# Altium schematic sheet 12V_Load_Switches.SchDoc
size A3; SheetNumber: 16; SheetTotal: 17
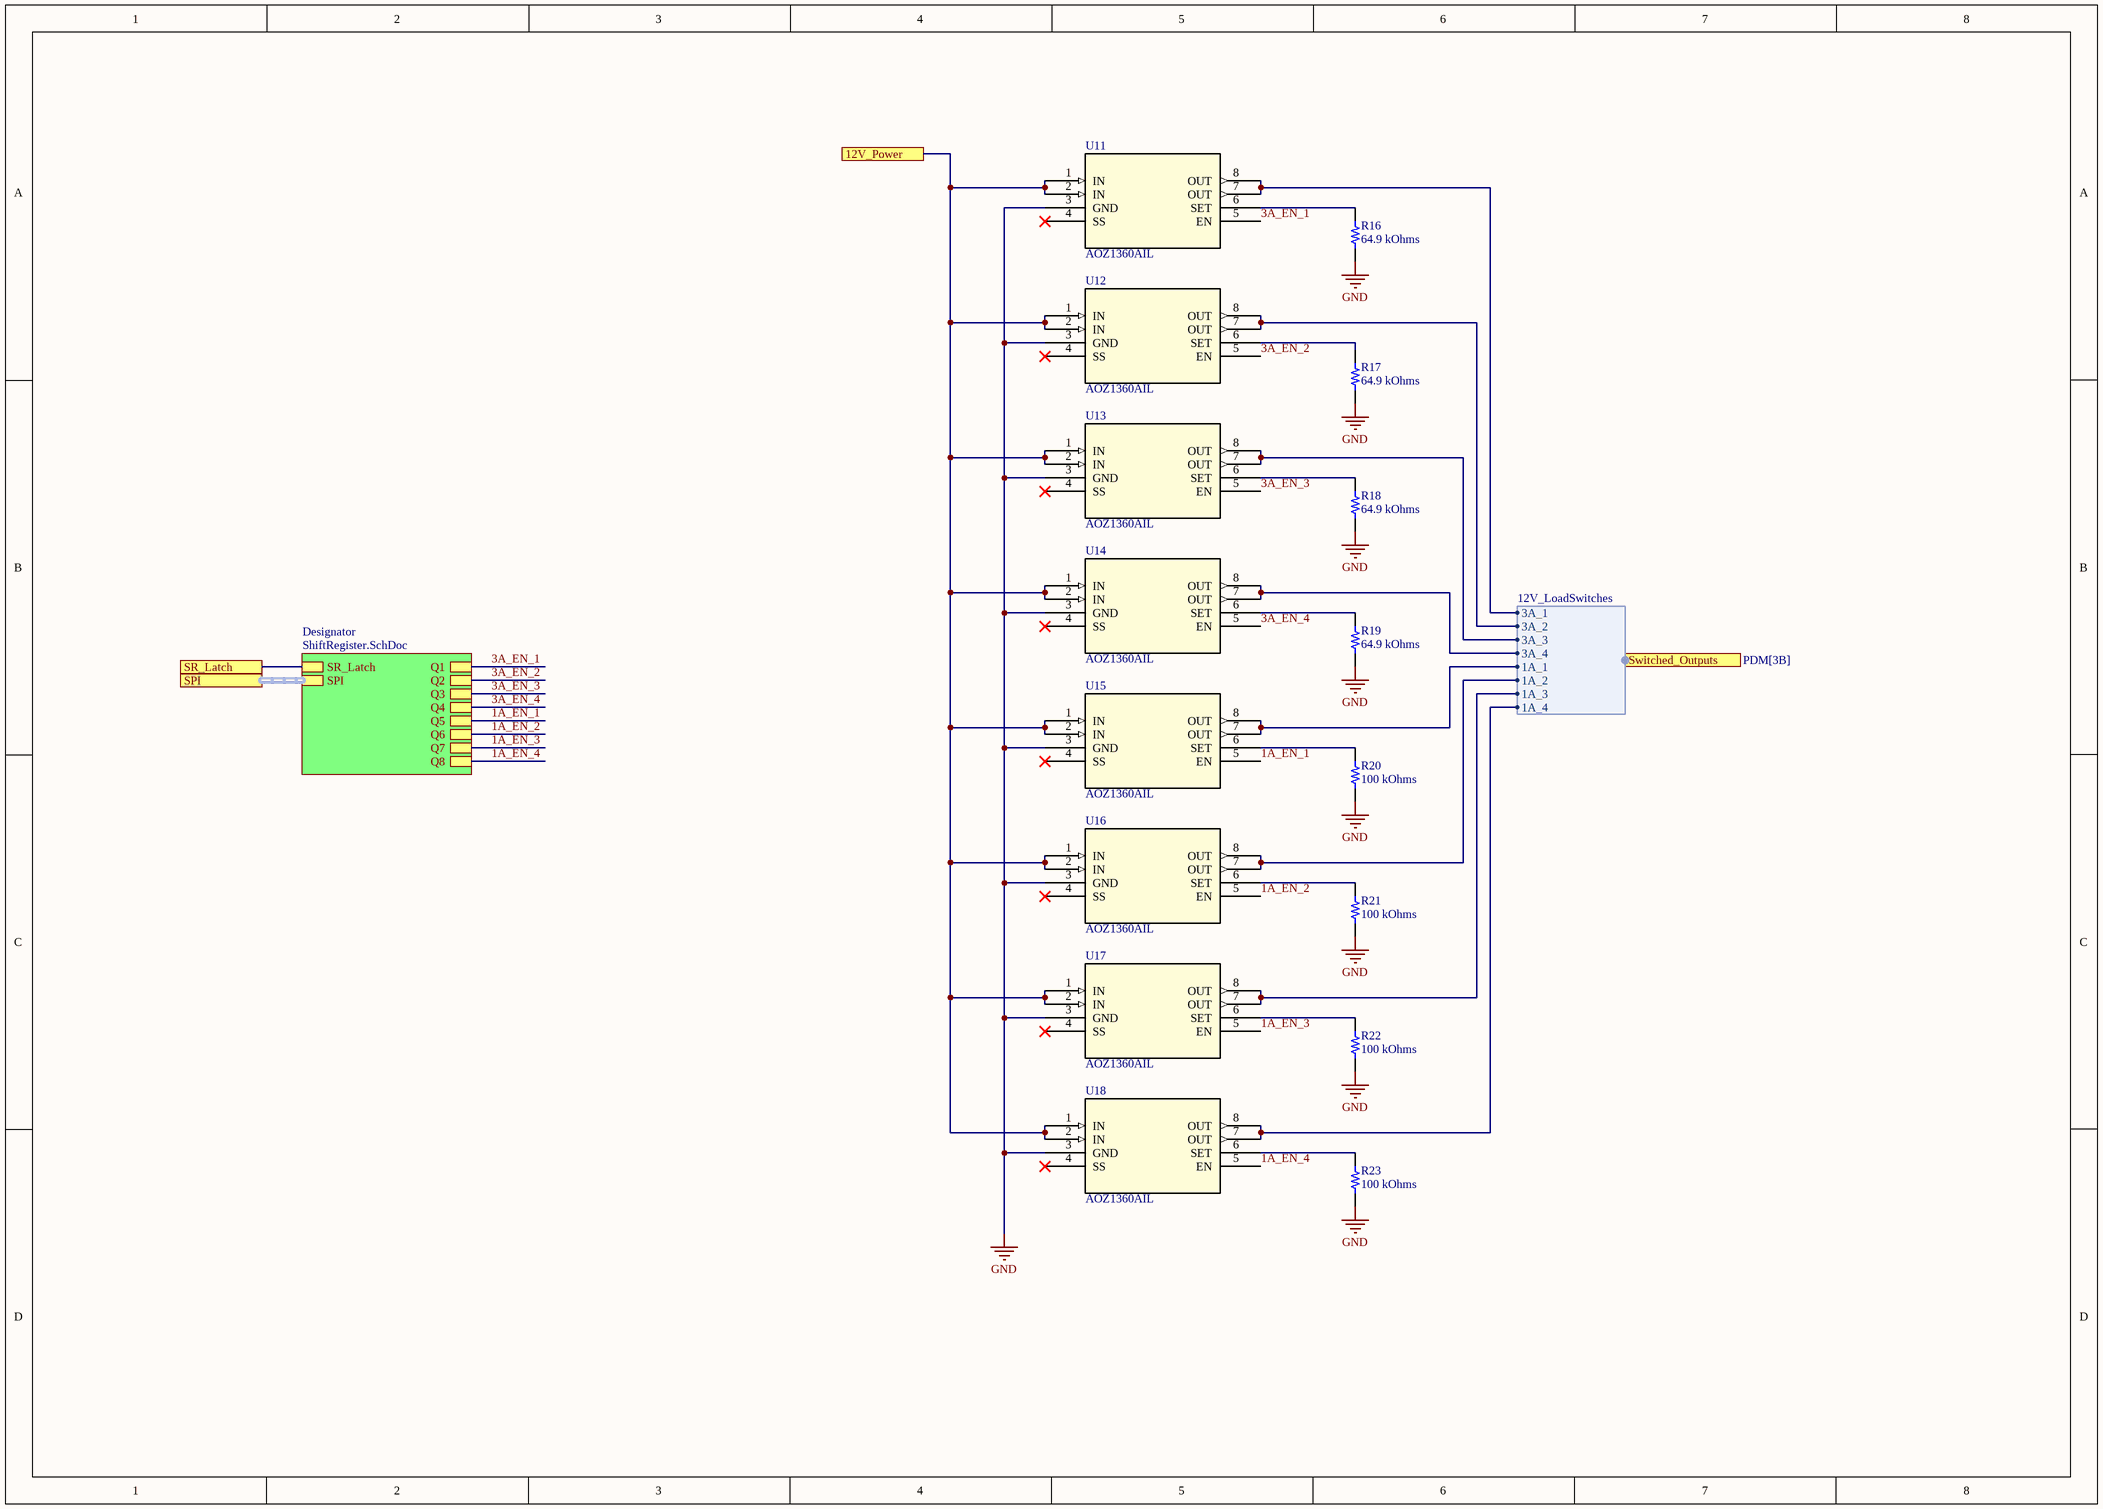
[diagram p0: 12V_Load_Switches.SchDoc]

## Parts
R16  64.9 kOhms  [RES 0603_1608]
R17  64.9 kOhms  [RES 0603_1608]
R18  64.9 kOhms  [RES 0603_1608]
R19  64.9 kOhms  [RES 0603_1608]
R20  100 kOhms  [RES 0603_1608]
R21  100 kOhms  [RES 0603_1608]
R22  100 kOhms  [RES 0603_1608]
R23  100 kOhms  [RES 0603_1608]
U11  AOZ1360AIL  [AOZ1360AIL_AOS]
U12  AOZ1360AIL  [AOZ1360AIL_AOS]
U13  AOZ1360AIL  [AOZ1360AIL_AOS]
U14  AOZ1360AIL  [AOZ1360AIL_AOS]
U15  AOZ1360AIL  [AOZ1360AIL_AOS]
U16  AOZ1360AIL  [AOZ1360AIL_AOS]
U17  AOZ1360AIL  [AOZ1360AIL_AOS]
U18  AOZ1360AIL  [AOZ1360AIL_AOS]

## Sub-sheets
Designator = ShiftRegister.SchDoc: SPI (harness SPI), SR_Latch, Q1, Q2, Q3, Q4, Q5, Q6, Q8, Q7

## Ports
12V_Power, SPI (harness SPI), SR_Latch, Switched_Outputs (harness 12V_LoadSwitches, see PDM[3B])

## Harnesses
12V_LoadSwitches: 3A_1, 3A_2, 3A_3, 3A_4, 1A_1, 1A_2, 1A_3, 1A_4

## Nets
GND: R16.1 R17.1 R18.1 R19.1 R20.1 R21.1 R22.1 R23.1 U11.3(GND) U12.3(GND) U13.3(GND) U14.3(GND) U15.3(GND) U16.3(GND) U17.3(GND) U18.3(GND)
1A_EN_1: U15.5(EN) ; sheet Designator/Q5
1A_EN_2: U16.5(EN) ; sheet Designator/Q6
1A_EN_3: U17.5(EN) ; sheet Designator/Q7
1A_EN_4: U18.5(EN) ; sheet Designator/Q8
3A_EN_1: U11.5(EN) ; sheet Designator/Q1
3A_EN_2: U12.5(EN) ; sheet Designator/Q2
3A_EN_3: U13.5(EN) ; sheet Designator/Q3
3A_EN_4: U14.5(EN) ; sheet Designator/Q4
12V_Power: U11.1(IN) U11.2(IN) U12.1(IN) U12.2(IN) U13.1(IN) U13.2(IN) U14.1(IN) U14.2(IN) U15.1(IN) U15.2(IN) U16.1(IN) U16.2(IN) U17.1(IN) U17.2(IN) U18.1(IN) U18.2(IN) ; port 12V_Power
SR_Latch: port SR_Latch, sheet Designator/SR_Latch
NetR16_2: R16.2 U11.6(SET)
NetR17_2: R17.2 U12.6(SET)
NetR18_2: R18.2 U13.6(SET)
NetR19_2: R19.2 U14.6(SET)
NetR20_2: R20.2 U15.6(SET)
NetR21_2: R21.2 U16.6(SET)
NetR22_2: R22.2 U17.6(SET)
NetR23_2: R23.2 U18.6(SET)
NetU11_7: U11.7(OUT) U11.8(OUT) ; port Switched_Outputs.3A_1
NetU12_7: U12.7(OUT) U12.8(OUT) ; port Switched_Outputs.3A_2
NetU13_7: U13.7(OUT) U13.8(OUT) ; port Switched_Outputs.3A_3
NetU14_7: U14.7(OUT) U14.8(OUT) ; port Switched_Outputs.3A_4
NetU15_7: U15.7(OUT) U15.8(OUT) ; port Switched_Outputs.1A_1
NetU16_7: U16.7(OUT) U16.8(OUT) ; port Switched_Outputs.1A_2
NetU17_7: U17.7(OUT) U17.8(OUT) ; port Switched_Outputs.1A_3
NetU18_7: U18.7(OUT) U18.8(OUT) ; port Switched_Outputs.1A_4

Not connected (* = marked no-connect by the designer): U11 4(SS)*; U12 4(SS)*; U13 4(SS)*; U14 4(SS)*; U15 4(SS)*; U16 4(SS)*; U17 4(SS)*; U18 4(SS)*

## Buses and harness runs
harness port SPI = sheet Designator/SPI

## Library data of the parts
R16-R19 = 7-2176089-3: RES SMD 64.9K OHM 0.1% 1/6W 0603; Manufacturer: TE Connectivity Passive Product; Power (Watts): 0.167W, 1/6W; Temperature Coefficient: ±25ppm/°C; Part Number: 7-2176089-3; Value: 64.9 kOhms; ComponentLink1Description: Datasheet; ComponentLink1URL: https://www.te.com/commerce/DocumentDelivery/DDEController?Action=srchrtrv&DocNm=1773272&DocType=DS&DocLang=English; ComponentLink2Description: DigiKey Link; ComponentLink2URL: https://www.digikey.com/en/products/detail/te-connectivity-passive-product/7-2176089-3/4033750; Composition: Thin Film; Device Package: 0603 (1608 Metric); Height - Seated (Max): 0.022" (0.55mm); LastUpdated: 12/19/2023 8:39:23 PM; Lifecycle Status: Active; Minimum Order: 1; Number of Terminations: 2; Operating Temperature: -55°C ~ 155°C; Package / Case: 0603 (1608 Metric); Packaging: TapeAndReel; PartId: 23912; Part Status: Active; Price: 0.14; Resistance: 64.9 kOhms; Series: RP73P, Holsworthy; Size / Dimension: 0.061" L x 0.031" W (1.55mm x 0.80mm); Supplier 1: DigiKey; Supplier Part Number 1: A110282CT-ND; Supplier Device Package: 0603; Tolerance: ±0.1%
R20-R23 = AA0603FR-07100KL: RES SMD 100K OHM 1% 1/10W 0603; Manufacturer: Yageo; Power (Watts): 0.1W, 1/10W; Temperature Coefficient: ±150ppm/°C; Part Number: AA0603FR-07100KL; Value: 100 kOhms; ComponentLink1Description: Datasheet; ComponentLink1URL: https://www.yageo.com/upload/media/product/productsearch/datasheet/rchip/PYu-AA_51_RoHS_L_3.pdf; ComponentLink2Description: DigiKey Link; ComponentLink2URL: https://www.digikey.com/en/products/detail/yageo/AA0603FR-07100KL/5888687; Composition: Thick Film; Device Package: 0603 (1608 Metric); Features: Anti-Sulfur, Automotive AEC-Q200, Moisture Resistant; Height - Seated (Max): 0.022" (0.55mm); LastUpdated: 12/20/2023 8:36:28 PM; Lifecycle Status: Active; Minimum Order: 1; Number of Terminations: 2; Operating Temperature: -55°C ~ 155°C; Package / Case: 0603 (1608 Metric); Packaging: TapeAndReel; PartId: 78895; Price: 0.01; Ratings: AEC-Q200; Resistance: 100 kOhms; Series: AA; Size / Dimension: 0.063" L x 0.031" W (1.60mm x 0.80mm); Supplier 1: DigiKey; Supplier Part Number 1: 13-AA0603FR-07100KLCT-ND; Supplier Device Package: 0603; Tolerance: ±1%
U11-U18 = AOZ1360AIL: No Description Available; Mfr_Name: Alpha and Omega Semiconductor; Copyright: Copyright (C) 2023 Ultra Librarian. All rights reserved.; Manufacturer_Part_Number: AOZ1360AIL; RefDes: RefDes; Type: DEV